# Altium schematic sheet CODEC.SchDoc
size A3; SheetNumber: 14; SheetTotal: 16
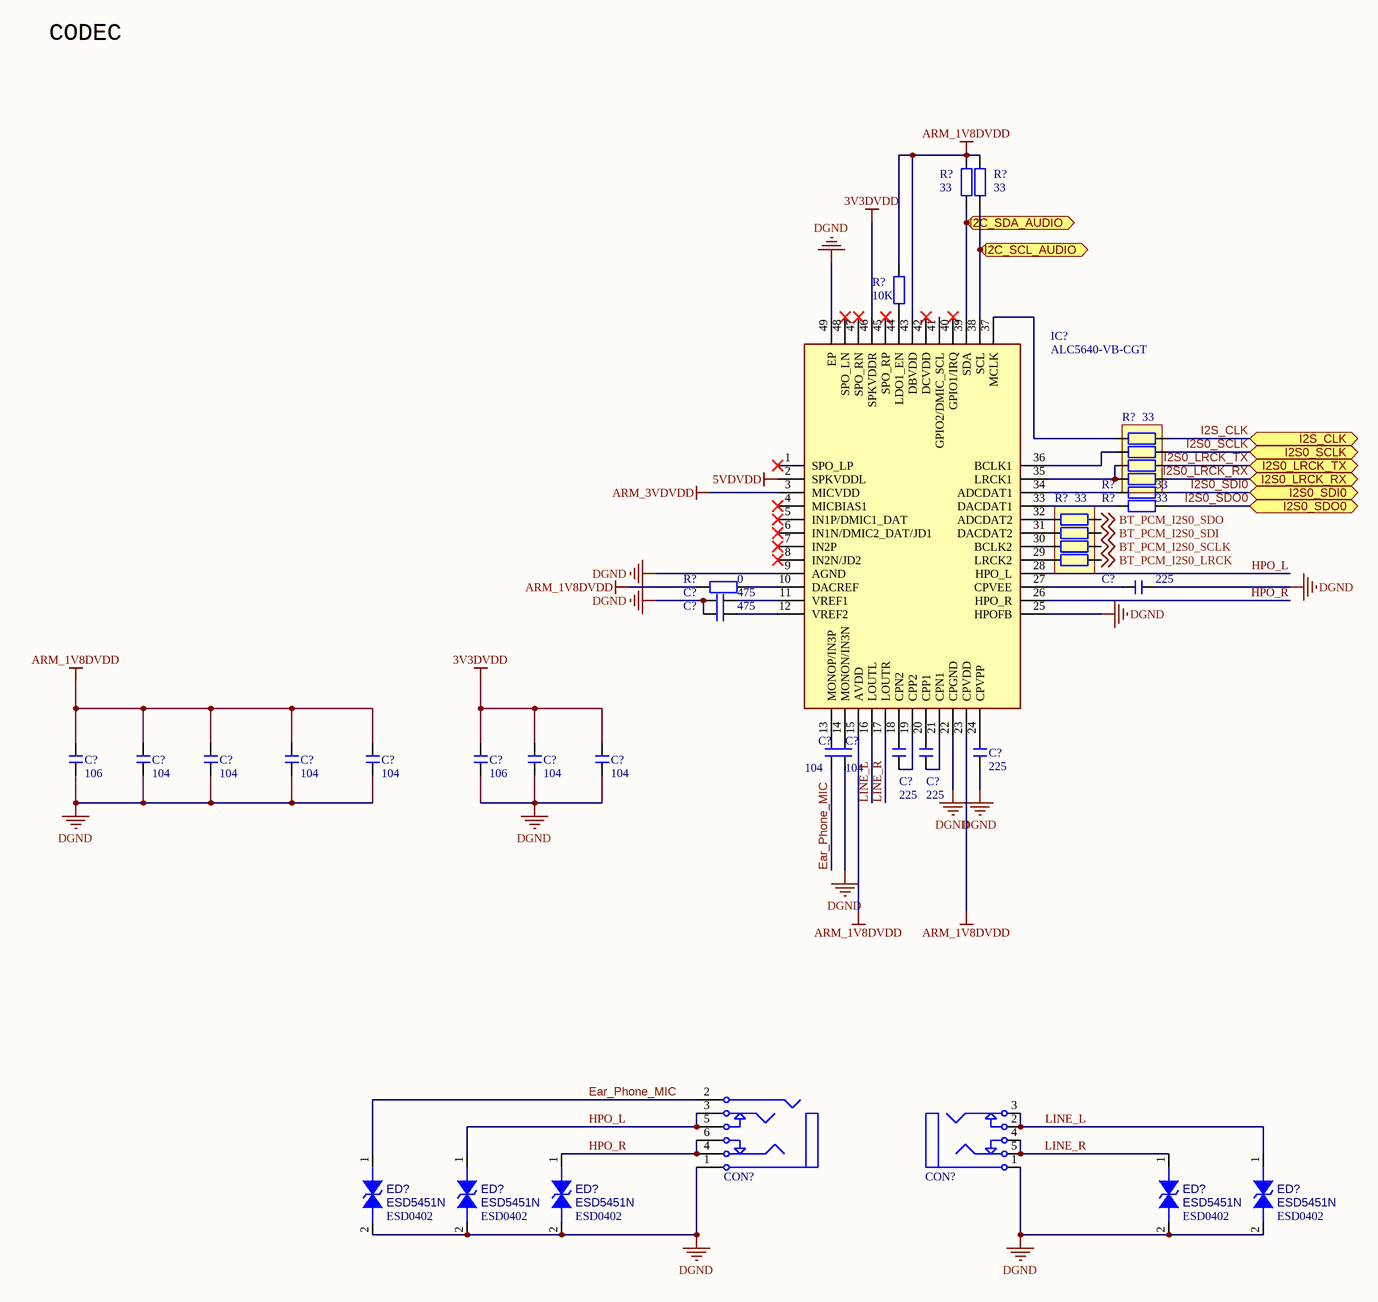
[diagram p0: CODEC.SchDoc]

## Parts
(Parts that share a designator on the sheet are numbered #1, #2 ... from top to bottom, then left to right.)
C?#1  225  [C 0603_L]
C?#2  475  [C 0603_L]
C?#3  475  [C 0603_L]
C?#4  104  [C 0603_L]
C?#5  104  [C 0603_L]
C?#6  225  [C 0603_L]
C?#7  225  [C 0603_L]
C?#8  225  [C 0603_L]
C?#9  106  [C 0603_L]
C?#10  104  [C 0603_L]
C?#11  104  [C 0603_L]
C?#12  104  [C 0603_L]
C?#13  104  [C 0603_L]
C?#14  106  [C 0603_L]
C?#15  104  [C 0603_L]
C?#16  104  [C 0603_L]
CON?#1  PJ325_BK  [PJ325_PK]  (value not drawn)
CON?#2  PJ342  [PJ342B]  (value not drawn)
ED?#1  value ESD5451N  [ESD0402]  (hidden comment: DIODE BI_DIR TRIG)
ED?#2  value ESD5451N  [ESD0402]  (hidden comment: DIODE BI_DIR TRIG)
ED?#3  value ESD5451N  [ESD0402]  (hidden comment: DIODE BI_DIR TRIG)
ED?#4  value ESD5451N  PCB Footprint: ESD0402  [SOD-323]  (hidden comment: DIODE BI_DIR TRIG)
ED?#5  value ESD5451N  PCB Footprint: ESD0402  [SOD-323]  (hidden comment: DIODE BI_DIR TRIG)
IC?  ALC5640-VB-CGT  [QFN40P600X600X100-49N]
R?#1  33  [R 0603_L]
R?#2  33  [R 0603_L]
R?#3  10K  [R 0603_L]
R?#4  33  [RCA-8P4R-0603]
R?#5  33  [R 0603_L]
R?#6  33  [R 0603_L]
R?#7  33  [RCA-8P4R-0603]
R?#8  0  [R 0603_L]

## Ports
I2C_SCL_AUDIO (bidir), I2C_SDA_AUDIO (bidir), I2S0_LRCK_RX (bidir), I2S0_LRCK_TX (bidir), I2S0_SCLK (bidir), I2S0_SDI0 (bidir), I2S0_SDO0 (bidir), I2S_CLK (bidir)

## Nets
3V3DVDD: C?#14.2 C?#15.2 C?#16.2 IC?.46(SPKVDDR)
5VDVDD: IC?.2(SPKVDDL)
ARM_1V8DVDD: C?#9.2 C?#10.2 C?#11.2 C?#12.2 C?#13.2 IC?.15(AVDD) IC?.23(CPVDD) IC?.43(DBVDD) R?#1.2 R?#2.2 R?#3.2 R?#8.1
ARM_3VDVDD: IC?.3(MICVDD)
DGND: C?#1.1 C?#2.2 C?#3.2 C?#5.2 C?#8.2 C?#9.1 C?#10.1 C?#11.1 C?#12.1 C?#13.1 C?#14.1 C?#15.1 C?#16.1 CON?#1.1 CON?#2.1 ED?#1.2 ED?#2.2 ED?#3.2 ED?#4.2 ED?#5.2 IC?.9(AGND) IC?.22(CPGND) IC?.25(HPOFB) IC?.49(EP)
BT_PCM_I2S0_LRCK: R?#7.5 ; off-sheet BT_PCM_I2S0_LRCK
BT_PCM_I2S0_SCLK: R?#7.6 ; off-sheet BT_PCM_I2S0_SCLK
BT_PCM_I2S0_SDI: R?#7.7 ; off-sheet BT_PCM_I2S0_SDI
BT_PCM_I2S0_SDO: R?#7.8 ; off-sheet BT_PCM_I2S0_SDO
Ear_Phone_MIC: C?#4.2 CON?#2.2 ED?#1.1
HPO_L: CON?#2.3 CON?#2.5 ED?#2.1 IC?.28(HPO_L)
HPO_R: CON?#2.4 CON?#2.6 ED?#3.1 IC?.26(HPO_R)
I2C_SCL_AUDIO: IC?.38(SCL) R?#2.1 ; port I2C_SCL_AUDIO
I2C_SDA_AUDIO: IC?.39(SDA) R?#1.1 ; port I2C_SDA_AUDIO
I2S0_LRCK_RX: R?#4.5 ; port I2S0_LRCK_RX
I2S0_LRCK_TX: R?#4.6 ; port I2S0_LRCK_TX
I2S0_SCLK: R?#4.7 ; port I2S0_SCLK
I2S0_SDI0: R?#5.2 ; port I2S0_SDI0
I2S0_SDO0: R?#6.2 ; port I2S0_SDO0
I2S_CLK: R?#4.8 ; port I2S_CLK
LINE_L: CON?#1.2 CON?#1.3 ED?#5.1 IC?.16(LOUTL)
LINE_R: CON?#1.4 CON?#1.5 ED?#4.1 IC?.17(LOUTR)
NetC?#1_2: C?#1.2 IC?.27(CPVEE)
NetC?#2_1: C?#2.1 IC?.11(VREF1)
NetC?#3_1: C?#3.1 IC?.12(VREF2)
NetC?#4_1: C?#4.1 IC?.13(MONOP/IN3P)
NetC?#5_1: C?#5.1 IC?.14(MONON/IN3N)
NetC?#6_1: C?#6.1 IC?.18(CPN2)
NetC?#6_2: C?#6.2 IC?.19(CPP2)
NetC?#7_1: C?#7.1 IC?.20(CPP1)
NetC?#7_2: C?#7.2 IC?.21(CPN1)
NetC?#8_1: C?#8.1 IC?.24(CPVPP)
NetIC?_10: IC?.10(DACREF) R?#8.2
NetIC?_29: IC?.29(LRCK2) R?#7.4
NetIC?_30: IC?.30(BCLK2) R?#7.3
NetIC?_31: IC?.31(DACDAT2) R?#7.2
NetIC?_32: IC?.32(ADCDAT2) R?#7.1
NetIC?_33: IC?.33(DACDAT1) R?#6.1
NetIC?_34: IC?.34(ADCDAT1) R?#5.1
NetIC?_35: IC?.35(LRCK1) R?#4.3 R?#4.4
NetIC?_36: IC?.36(BCLK1) R?#4.2
NetIC?_37: IC?.37(MCLK) R?#4.1
NetIC?_44: IC?.44(LDO1_EN) R?#3.1

Not connected (* = marked no-connect by the designer): IC? 1(SPO_LP)* 4(MICBIAS1)* 5(IN1P/DMIC1_DAT)* 6(IN1N/DMIC2_DAT/JD1)* 7(IN2P)* 8(IN2N/JD2)* 40(GPIO1/IRQ)* 41(GPIO2/DMIC_SCL) 42(DCVDD)* 45(SPO_RP)* 47(SPO_RN)* 48(SPO_LN)*

## Notes on the sheet
- CODEC

## Library data of the parts
C?#1-C?#16 = C: 贴片电容
CON?#1 = PJ325: 3.5mm耳机插座; BOM名称: 耳机插座; 版权归属: 封装库来自淘宝 ID：黄晶宝石; 学习资源: https://shop463601444.taobao.com
CON?#2 = PJ342: 3.5耳机插座,4Pin; BOM名称: 耳机插座; 版权归属: 封装库来自淘宝 ID：黄晶宝石; 学习资源: https://shop463601444.taobao.com
ED?#1 = DIODE BI_DIR TRIG: 1-Line, Bi-directional, Transient Voltage Suppressors.17.5pF.; Part Reference: ED7101; Manufacturer: WillSemi(韦尔半导体); Priority: A; PCB Footprint: ESD0402; RK PN: ESD5451N; Part Type: ESD_TVS; Manufacturer PN: ESD5451N; Created by: JJJ
ED?#2 = DIODE BI_DIR TRIG: 1-Line, Bi-directional, Transient Voltage Suppressors.17.5pF.; Part Reference: ED7103; Manufacturer: WillSemi(韦尔半导体); Priority: A; PCB Footprint: ESD0402; Created by: JJJ; Manufacturer PN: ESD5451N; Part Type: ESD_TVS; RK PN: ESD5451N
ED?#3 = DIODE BI_DIR TRIG: 1-Line, Bi-directional, Transient Voltage Suppressors.17.5pF.; Part Reference: ED7102; Manufacturer: WillSemi(韦尔半导体); Priority: A; PCB Footprint: ESD0402; Created by: JJJ; Manufacturer PN: ESD5451N; Part Type: ESD_TVS; RK PN: ESD5451N
ED?#4 ED?#5 = DIODE BI_DIR TRIG: 1-Line, Bi-directional, Transient Voltage Suppressors.17.5pF.; Part Reference: ED7104; Manufacturer: WillSemi(韦尔半导体); Priority: A; Created by: JJJ; Manufacturer PN: ESD5451N; Part Type: ESD_TVS; RK PN: ESD5451N
IC? = ALC5640-VB-CGT: Integrated Circuit; Manufacturer_Name: Realtek; Datasheet Link: https://www.alldatasheet.com/view.jsp?Searchword=ALC5640-VB-CGT; Height: 1mm; Manufacturer_Part_Number: ALC5640-VB-CGT
R?#1-R?#3 R?#5 R?#6 R?#8 = 0805 电阻: 贴片电阻 0805 电阻; ComponentLink1Description: 供应商链接; ComponentLink1URL: http://www.szlcsc.com/product/details_18165.html; Package: 0805; Supplier: LC; SuppliersPartNumber: C17477
R?#4 R?#7 = R-8P4R: 贴片排阻; BOM名称: 贴片网络排阻